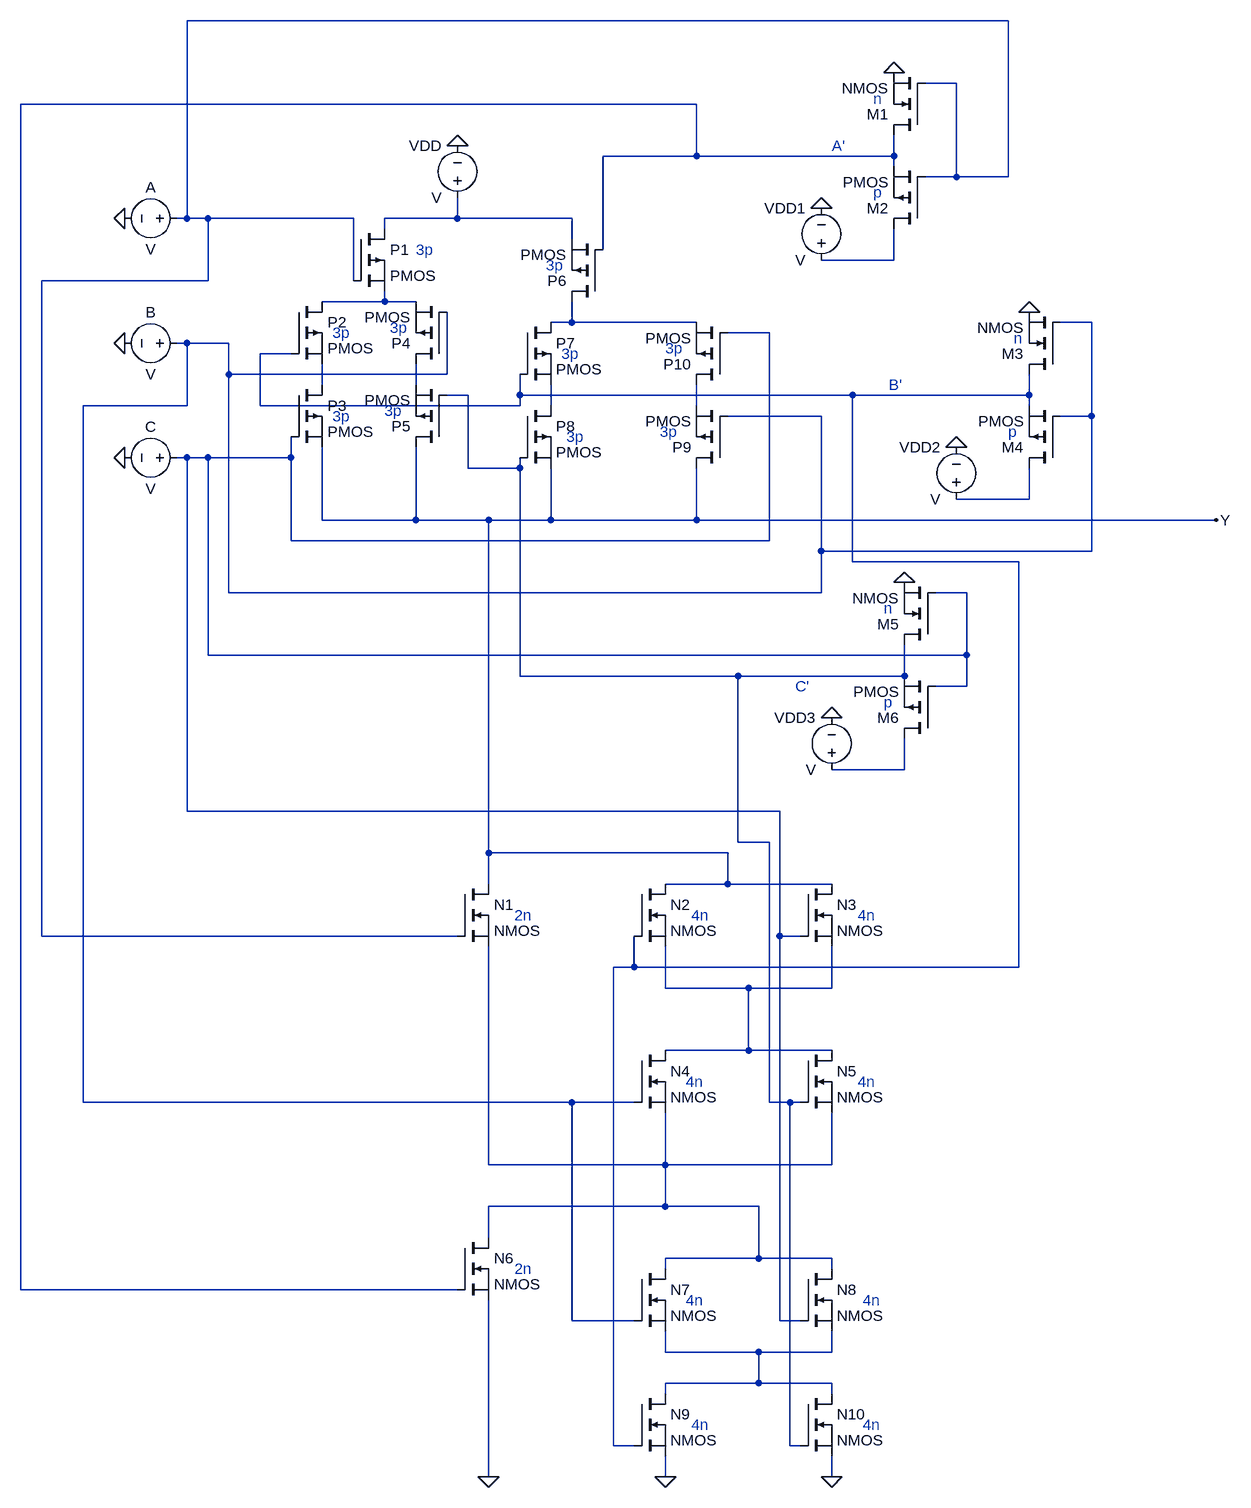
[diagram p0: schematic parity-checker schematic.asc]
parity-checker schematic.asc, the LTspice schematic file:
Version 4.1
SHEET 1 1456 1956
WIRE 1104 -304 -160 -304
WIRE 1024 -208 976 -208
WIRE 624 -176 -416 -176
WIRE 624 -96 624 -176
WIRE 624 -96 480 -96
WIRE 928 -96 928 -128
WIRE 928 -96 624 -96
WIRE 928 -80 928 -96
WIRE 1024 -64 1024 -208
WIRE 1024 -64 976 -64
WIRE 1104 -64 1104 -304
WIRE 1104 -64 1024 -64
WIRE -160 0 -160 -304
WIRE -160 0 -176 0
WIRE -128 0 -160 0
WIRE 96 0 -128 0
WIRE 256 0 256 -32
WIRE 256 0 144 0
WIRE 432 0 256 0
WIRE 144 16 144 0
WIRE 432 32 432 0
WIRE 480 48 480 -96
WIRE 928 64 928 16
WIRE 928 64 816 64
WIRE -128 96 -128 0
WIRE -128 96 -384 96
WIRE 96 96 96 0
WIRE 144 128 144 112
WIRE 144 128 48 128
WIRE 192 128 144 128
WIRE 432 160 432 128
WIRE 432 160 400 160
WIRE 624 160 432 160
WIRE 1232 160 1184 160
WIRE 736 176 672 176
WIRE -160 192 -176 192
WIRE -96 192 -160 192
WIRE 0 208 -48 208
WIRE -96 240 -96 192
WIRE 240 240 240 144
WIRE 240 240 -96 240
WIRE 48 256 48 224
WIRE 192 256 192 224
WIRE 272 272 240 272
WIRE 352 272 352 240
WIRE 864 272 352 272
WIRE 1136 272 1136 240
WIRE 1136 272 864 272
WIRE -160 288 -160 192
WIRE -160 288 -320 288
WIRE -48 288 -48 208
WIRE 352 288 352 272
WIRE 352 288 -48 288
WIRE 400 288 400 256
WIRE 624 288 624 256
WIRE 1136 288 1136 272
WIRE 816 304 672 304
WIRE 1232 304 1232 160
WIRE 1232 304 1184 304
WIRE -160 368 -176 368
WIRE -128 368 -160 368
WIRE 0 368 0 336
WIRE 0 368 -128 368
WIRE 272 384 272 272
WIRE 352 384 352 368
WIRE 352 384 272 384
WIRE 1136 432 1136 384
WIRE 1136 432 1024 432
WIRE 48 464 48 352
WIRE 192 464 192 352
WIRE 192 464 48 464
WIRE 304 464 192 464
WIRE 400 464 400 384
WIRE 400 464 304 464
WIRE 624 464 624 384
WIRE 624 464 400 464
WIRE 1424 464 624 464
WIRE 0 496 0 368
WIRE 736 496 736 176
WIRE 736 496 0 496
WIRE 816 512 816 304
WIRE 1232 512 1232 304
WIRE 1232 512 816 512
WIRE 864 528 864 272
WIRE 1120 528 864 528
WIRE -96 576 -96 240
WIRE 816 576 816 512
WIRE 816 576 -96 576
WIRE 1040 576 992 576
WIRE -128 672 -128 368
WIRE 1040 672 1040 576
WIRE 1040 672 -128 672
WIRE 352 704 352 384
WIRE 688 704 352 704
WIRE 944 704 944 656
WIRE 944 704 688 704
WIRE 1040 720 1040 672
WIRE 1040 720 992 720
WIRE 944 848 944 800
WIRE 944 848 832 848
WIRE -160 912 -160 368
WIRE 752 912 -160 912
WIRE 688 960 688 704
WIRE 736 960 688 960
WIRE 304 976 304 464
WIRE 672 976 304 976
WIRE 304 1024 304 976
WIRE 672 1024 672 976
WIRE 672 1024 576 1024
WIRE 832 1024 672 1024
WIRE -384 1104 -384 96
WIRE 256 1104 -384 1104
WIRE 752 1104 752 912
WIRE 784 1104 752 1104
WIRE 528 1152 528 1104
WIRE 528 1152 496 1152
WIRE 1120 1152 1120 528
WIRE 1120 1152 528 1152
WIRE 576 1184 576 1120
WIRE 704 1184 576 1184
WIRE 832 1184 832 1120
WIRE 832 1184 704 1184
WIRE 704 1280 704 1184
WIRE 704 1280 576 1280
WIRE 832 1280 704 1280
WIRE -320 1360 -320 288
WIRE 432 1360 -320 1360
WIRE 528 1360 432 1360
WIRE 736 1360 736 960
WIRE 768 1360 736 1360
WIRE 784 1360 768 1360
WIRE 304 1456 304 1120
WIRE 576 1456 576 1376
WIRE 576 1456 304 1456
WIRE 832 1456 832 1376
WIRE 832 1456 576 1456
WIRE 576 1520 576 1456
WIRE 576 1520 304 1520
WIRE 720 1520 576 1520
WIRE 304 1568 304 1520
WIRE 720 1600 720 1520
WIRE 720 1600 576 1600
WIRE 832 1600 720 1600
WIRE 576 1616 576 1600
WIRE 832 1616 832 1600
WIRE -416 1648 -416 -176
WIRE 256 1648 -416 1648
WIRE 432 1696 432 1360
WIRE 528 1696 432 1696
WIRE 752 1696 752 1104
WIRE 784 1696 752 1696
WIRE 576 1744 576 1712
WIRE 720 1744 576 1744
WIRE 832 1744 832 1712
WIRE 832 1744 720 1744
WIRE 720 1792 720 1744
WIRE 720 1792 576 1792
WIRE 832 1792 720 1792
WIRE 576 1808 576 1792
WIRE 832 1808 832 1792
WIRE 496 1888 496 1152
WIRE 528 1888 496 1888
WIRE 768 1888 768 1360
WIRE 784 1888 768 1888
WIRE 304 1936 304 1664
WIRE 576 1936 576 1904
WIRE 832 1936 832 1904
FLAG 256 -112 0
FLAG 1424 464 Y
FLAG 816 -16 0
FLAG 928 -224 0
FLAG -256 368 0
FLAG -256 192 0
FLAG -256 0 0
FLAG 1024 352 0
FLAG 1136 144 0
FLAG 832 768 0
FLAG 944 560 0
FLAG 304 1936 0
FLAG 832 1936 0
FLAG 576 1936 0
SYMBOL pmos 96 16 R0
SYMATTR InstName P1
SYMBOL pmos 0 128 R0
SYMATTR InstName P2
SYMBOL pmos 240 224 R180
SYMATTR InstName P4
SYMBOL pmos 672 384 R180
SYMATTR InstName P9
SYMBOL pmos 480 128 R180
SYMATTR InstName P6
SYMBOL pmos 352 160 R0
SYMATTR InstName P7
SYMBOL pmos 352 288 R0
SYMATTR InstName P8
SYMBOL pmos 0 256 R0
SYMATTR InstName P3
SYMBOL pmos 240 352 R180
SYMATTR InstName P5
SYMBOL pmos 672 256 R180
SYMATTR InstName P10
SYMBOL voltage 256 -16 R180
WINDOW 0 24 96 Left 2
WINDOW 3 24 16 Left 2
SYMATTR InstName VDD
SYMBOL nmos 976 -128 R180
SYMATTR InstName M1
SYMBOL pmos 976 16 R180
SYMATTR InstName M2
SYMBOL voltage 816 80 R180
WINDOW 0 24 96 Left 2
WINDOW 3 24 16 Left 2
SYMATTR InstName VDD1
SYMBOL voltage -160 0 R90
WINDOW 0 -32 56 VBottom 2
WINDOW 3 32 56 VTop 2
SYMATTR InstName A
SYMBOL voltage -160 192 R90
WINDOW 0 -32 56 VBottom 2
WINDOW 3 32 56 VTop 2
SYMATTR InstName B
SYMBOL voltage -160 368 R90
WINDOW 0 -32 56 VBottom 2
WINDOW 3 32 56 VTop 2
SYMATTR InstName C
SYMBOL nmos 1184 240 R180
SYMATTR InstName M3
SYMBOL pmos 1184 384 R180
SYMATTR InstName M4
SYMBOL voltage 1024 448 R180
WINDOW 0 24 96 Left 2
WINDOW 3 24 16 Left 2
SYMATTR InstName VDD2
SYMBOL nmos 992 656 R180
SYMATTR InstName M5
SYMBOL pmos 992 800 R180
SYMATTR InstName M6
SYMBOL voltage 832 864 R180
WINDOW 0 24 96 Left 2
WINDOW 3 24 16 Left 2
SYMATTR InstName VDD3
SYMBOL nmos 256 1024 R0
SYMATTR InstName N1
SYMBOL nmos 528 1024 R0
SYMATTR InstName N2
SYMBOL nmos 784 1024 R0
SYMATTR InstName N3
SYMBOL nmos 528 1280 R0
SYMATTR InstName N4
SYMBOL nmos 784 1280 R0
SYMATTR InstName N5
SYMBOL nmos 256 1568 R0
SYMATTR InstName N6
SYMBOL nmos 528 1616 R0
SYMATTR InstName N7
SYMBOL nmos 784 1616 R0
SYMATTR InstName N8
SYMBOL nmos 528 1808 R0
SYMATTR InstName N9
SYMBOL nmos 784 1808 R0
SYMATTR InstName N10
TEXT 832 -112 Left 2 ;A'
TEXT 920 256 Left 2 ;B'
TEXT 776 720 Left 2 ;C'
TEXT 616 1856 Left 2 ;4n
TEXT 880 1856 Left 2 ;4n
TEXT 880 1664 Left 2 ;4n
TEXT 608 1664 Left 2 ;4n
TEXT 608 1328 Left 2 ;4n
TEXT 872 1328 Left 2 ;4n
TEXT 616 1072 Left 2 ;4n
TEXT 872 1072 Left 2 ;4n
TEXT 344 1072 Left 2 ;2n
TEXT 344 1616 Left 2 ;2n
TEXT 192 48 Left 2 ;3p
TEXT 152 168 Left 2 ;3p
TEXT 64 176 Left 2 ;3p
TEXT 64 304 Left 2 ;3p
TEXT 144 296 Left 2 ;3p
TEXT 392 72 Left 2 ;3p
TEXT 416 208 Left 2 ;3p
TEXT 576 200 Left 2 ;3p
TEXT 424 336 Left 2 ;3p
TEXT 568 328 Left 2 ;3p
TEXT 896 -40 Left 2 ;p
TEXT 1104 328 Left 2 ;p
TEXT 912 744 Left 2 ;p
TEXT 912 600 Left 2 ;n
TEXT 1112 184 Left 2 ;n
TEXT 896 -184 Left 2 ;n

The netlist it stands for:
* parity-checker schematic.asc
M§P1 N003 N001 N005 N005 PMOS
M§P2 N005 N009 N010 N010 PMOS
M§P4 N011 N007 N005 N005 PMOS
M§P9 Y N007 N014 N014 PMOS
M§P6 N006 N002 N003 N003 PMOS
M§P7 N006 N009 N013 N013 PMOS
M§P8 N013 N012 Y Y PMOS
M§P3 N010 N008 Y Y PMOS
M§P5 Y N012 N011 N011 PMOS
M§P10 N014 N008 N006 N006 PMOS
VDD N003 0 V
M1 N002 N001 0 0 NMOS
M2 N004 N001 N002 N002 PMOS
VDD1 N004 0 V
V§A N001 0 V
V§B N007 0 V
V§C N008 0 V
M3 N009 N007 0 0 NMOS
M4 N015 N007 N009 N009 PMOS
VDD2 N015 0 V
M5 N012 N008 0 0 NMOS
M6 N016 N008 N012 N012 PMOS
VDD3 N016 0 V
M§N1 Y N001 N018 N018 NMOS
M§N2 Y N009 N017 N017 NMOS
M§N3 Y N008 N017 N017 NMOS
M§N4 N017 N007 N018 N018 NMOS
M§N5 N017 N012 N018 N018 NMOS
M§N6 N018 N002 0 0 NMOS
M§N7 N018 N007 N019 N019 NMOS
M§N8 N018 N008 N019 N019 NMOS
M§N9 N019 N009 0 0 NMOS
M§N10 N019 N012 0 0 NMOS
.model NMOS NMOS
.model PMOS PMOS
.lib standard.mos
* A'
* B'
* C'
* 4n
* 4n
* 4n
* 4n
* 4n
* 4n
* 4n
* 4n
* 2n
* 2n
* 3p
* 3p
* 3p
* 3p
* 3p
* 3p
* 3p
* 3p
* 3p
* 3p
* p
* p
* p
* n
* n
* n
.backanno
.end